# Altium project callisto_pcb.PrjPcb
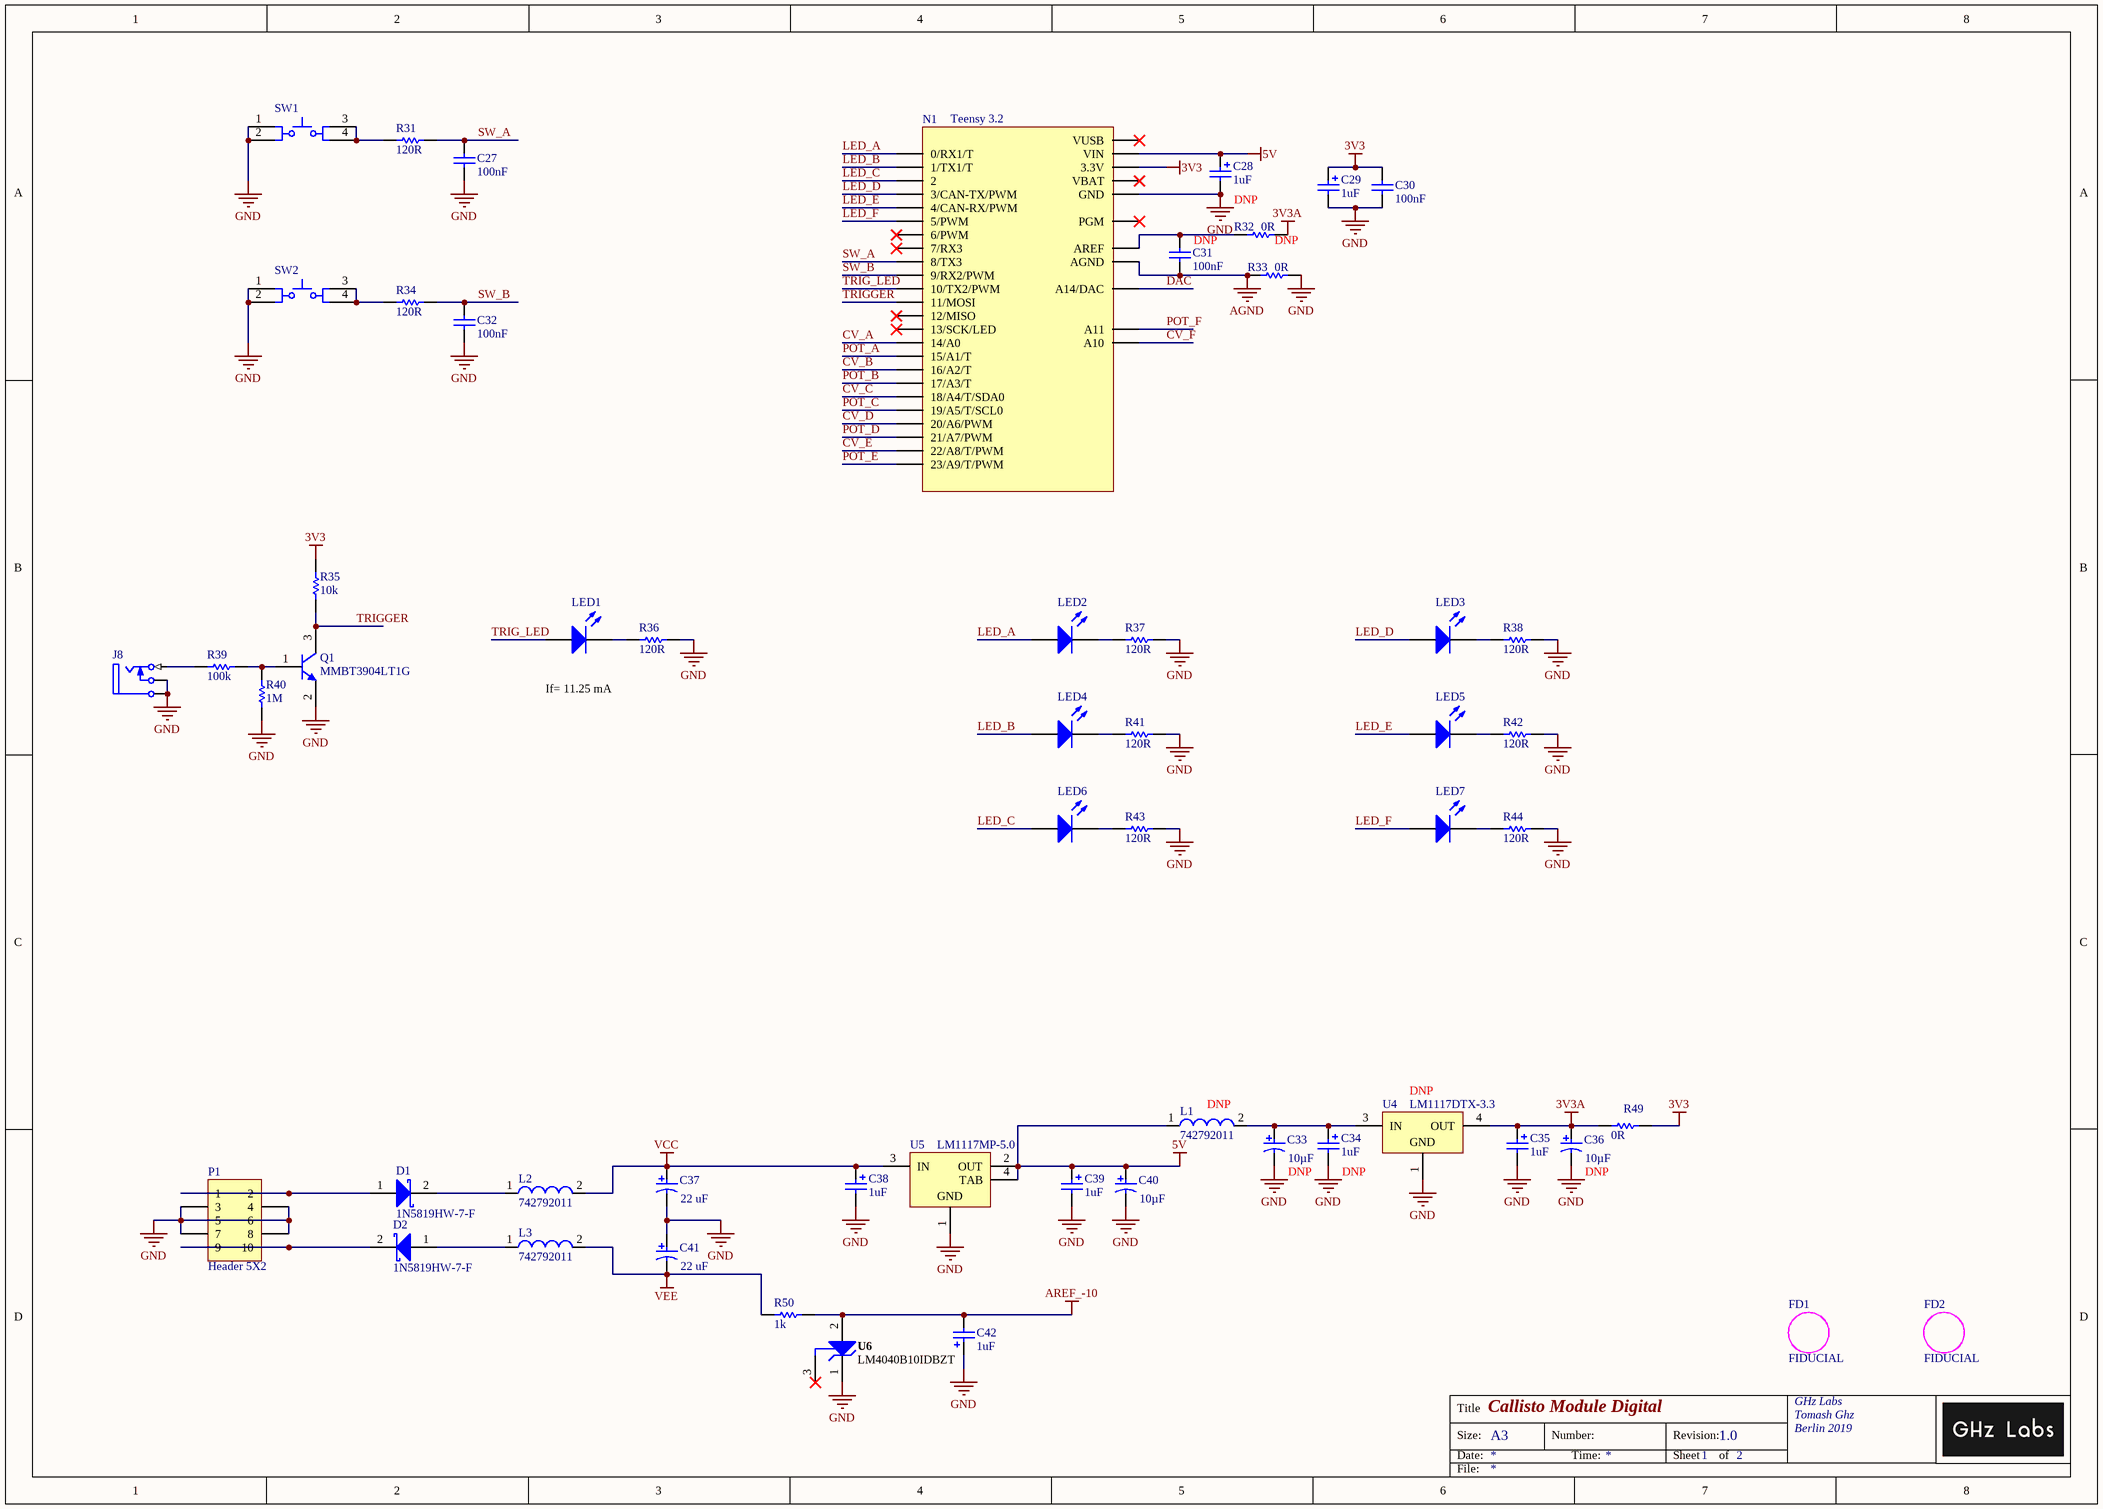
[diagram p0: callisto_schematics_digital.SchDoc]
2 sheets, 121 parts. Net scope: global (net labels, ports and power ports of the same name join across sheets).
Board files: callisto_board.PcbDoc, callisto_panel.PcbDoc
Sheets:
  callisto_schematics_digital.SchDoc
  callisto_schematics_analog.SchDoc

## Sheet callisto_schematics_digital.SchDoc: Callisto Module Digital
size A3; ApprovedBy: Tomash Ghz; CheckedBy: Tomash Ghz; Author: Tomash Ghz; CompanyName: GHz Labs; DrawnBy: Tomash Ghz; Engineer: Tomash Ghz; Organization: GHz Labs; Address1: Tomash Ghz; Address2: Berlin 2019; Revision: 1.0; SheetNumber: 1; SheetTotal: 2; DocumentName: Callisto Module Digital; ProjectName: Callisto Module

### Parts
C27  100nF  [CAPA_0805]
C28  1uF  [CAPA_0805 Pol]
C29  1uF  [CAPA_0805 Pol]
C30  100nF  [CAPA_0805]
C31  100nF  [CAPA_0805]
C32  100nF  [CAPA_0805]
C33  Capacitance: 10µF  [PNSC-FK-V-B_V]  (hidden comment: EEE-FK1V100UR)
C34  1uF  [CAPA_0805 Pol]
C35  1uF  [CAPA_0805 Pol]
C36  Capacitance: 10µF  [PNSC-FK-V-B_V]  (hidden comment: EEE-FK1V100UR)
C37  Rated Capacitance: 22 uF  [NIC-CAPA2-5X5.8_V]  (hidden comment: 22uF Electrolytic Capacitor)
C38  1uF  [CAPA_0805 Pol]
C39  1uF  [CAPA_0805 Pol]
C40  Capacitance: 10µF  [PNSC-FK-V-B_V]  (hidden comment: 10uF Electrolytic Capacitor)
C41  Rated Capacitance: 22 uF  [NIC-CAPA2-5X5.8_V]  (hidden comment: 22uF Electrolytic Capacitor)
C42  1uF  [CAPA_0805 Pol]
D1  1N5819HW-7-F  [DIOD-SOD-123-2_V]
D2  1N5819HW-7-F  [DIOD-SOD-123-2_V]
FD1  FIDUCIAL  [FIDUCIAL]  (no BOM)
FD2  FIDUCIAL  [FIDUCIAL]  (no BOM)
J8  Phonejack2 TN  [Thonkiconn]  (value not drawn)
L1  742792011  [SMD-0805]
L2  742792011  [SMD-0805]
L3  742792011  [SMD-0805]
LED1  WP424YDT  [Type 3mm]  (value not drawn)
LED2  WP424YDT  [Type 3mm]  (value not drawn)
LED3  WP424YDT  [Type 3mm]  (value not drawn)
LED4  WP424YDT  [Type 3mm]  (value not drawn)
LED5  WP424YDT  [Type 3mm]  (value not drawn)
LED6  WP424YDT  [Type 3mm]  (value not drawn)
LED7  WP424YDT  [Type 3mm]  (value not drawn)
N1  Teensy 3.2  [TEENSY_3.0-3.2&LC_ALL_PINS]
P1  Header 5X2  [HDR2X5]
Q1  MMBT3904LT1G  [ONSC-SOT-23-3-318-08_V]
R31  120R  [RES_0805]
R32  0R  [RES_0805]
R33  0R  [RES_0805]
R34  120R  [RES_0805]
R35  10k  [RES_0805]
R36  120R  [RES_0805]
R37  120R  [RES_0805]
R38  120R  [RES_0805]
R39  100k  [RES_0805]
R40  1M  [RES_0805]
R41  120R  [RES_0805]
R42  120R  [RES_0805]
R43  120R  [RES_0805]
R44  120R  [RES_0805]
R49  0R  [RES_0805]
R50  1k  [RES_0805]
SW1  Tact Switch  [ESWI-TL1105SPF_V]  (value not drawn)
SW2  Tact Switch  [ESWI-TL1105SPF_V]  (value not drawn)
U4  LM1117DTX-3.3  [TD03B_M]
U5  LM1117MP-5.0  [MP04A_M]
U6  LM4040B10IDBZT  [DBZ0003A_M]

### Nets
3V3: C29.1 C30.1 N1.3.3V_3.3V1(3.3V) R35.1 R49.2
3V3A: C35.1 C36.1 R32.2 R49.1 U4.4(OUT)
5V: C28.1 C39.1 C40.1 L1.1 N1.VIN U5.2(OUT) U5.4(TAB)
AGND: C31.2 N1.AGND R33.1
AREF_-10: C42.2 R50.1 U6.2(ANODE)
GND: C27.2 C28.2 C29.2 C30.2 C32.2 C33.2 C34.2 C35.2 C36.2 C37.2 C38.2 C39.2 C40.2 C41.1 C42.1 J8.2(TN) J8.5(S) N1.GND_GND1(GND) P1.3 P1.4 P1.5 P1.6 P1.7 P1.8 Q1.2(E) R33.2 R36.1 R37.1 R38.1 R40.2 R41.1 R42.1 R43.1 R44.1 SW1.1 SW1.2 SW2.1 SW2.2 U4.1(GND) U5.1(GND) U6.1(CATHODE)
VCC: C37.1 C38.1 L2.2 U5.3(IN)
VEE: C41.2 L3.2 R50.2
CV_A: N1.14/A0
CV_B: N1.16/A2(16/A2/T)
CV_C: N1.18/A4(18/A4/T/SDA0)
CV_D: N1.20/A6(20/A6/PWM)
CV_E: N1.22/A8(22/A8/T/PWM)
CV_F: N1.A10
DAC: N1.RESET/DAC(A14/DAC)
LED_A: LED2.2(A) N1.0(0/RX1/T)
LED_B: LED4.2(A) N1.1(1/TX1/T)
LED_C: LED6.2(A) N1.2
LED_D: LED3.2(A) N1.3(3/CAN-TX/PWM)
LED_E: LED5.2(A) N1.4(4/CAN-RX/PWM)
LED_F: LED7.2(A) N1.5(5/PWM)
POT_A: N1.15/A1(15/A1/T)
POT_B: N1.17/A3(17/A3/T)
POT_C: N1.19/A5(19/A5/T/SCL0)
POT_D: N1.21/A7(21/A7/PWM)
POT_E: N1.23/A9(23/A9/T/PWM)
POT_F: N1.A11
SW_A: C27.1 N1.8(8/TX3) R31.1
SW_B: C32.1 N1.9(9/RX2/PWM) R34.1
TRIG_LED: LED1.2(A) N1.10(10/TX2/PWM)
TRIGGER: N1.11(11/MOSI) Q1.3(C) R35.2
NetC31_1: C31.1 N1.AREF R32.1
NetC33_1: C33.1 C34.1 L1.2 U4.3(IN)
NetD1_1: D1.1(A) P1.1 P1.2
NetD1_2: D1.2(K) L2.1
NetD2_1: D2.1(A) L3.1
NetD2_2: D2.2(K) P1.9 P1.10
NetJ8_1: J8.1(T) R39.2
NetLED1_1: LED1.1(K) R36.2
NetLED2_1: LED2.1(K) R37.2
NetLED3_1: LED3.1(K) R38.2
NetLED4_1: LED4.1(K) R41.2
NetLED5_1: LED5.1(K) R42.2
NetLED6_1: LED6.1(K) R43.2
NetLED7_1: LED7.1(K) R44.2
NetQ1_1: Q1.1(B) R39.1 R40.1
NetR31_2: R31.2 SW1.3 SW1.4
NetR34_2: R34.2 SW2.3 SW2.4

Not connected (* = marked no-connect by the designer): N1 6(6/PWM)* 7(7/RX3)* 12(12/MISO)* 13(13/SCK/LED)* PGM* VBAT* VUSB*; U6 3(NC)*

### Notes on the sheet
- (near C31) DNP
- DNP
- (near R32) DNP
- If= 11.25 mA
- (near L1) DNP
- (near U4) DNP
- (near C36) DNP
- Title
- Size:
- Date:
- A3
- Number:
- Time:
- Revision:
- Sheet
- of
- File:

### Library data of the parts
C27 C30-C32 = Cap: Capacitor; PartNumber: C0805C104K4RAC; Manufacturer: KEMET; Published: 8-Jun-2000; LatestRevisionDate: 17-Jul-2002; LatestRevisionNote: Re-released for DXP Platform.; PackageReference: RAD-0.3; Publisher: Altium Limited; PackageDescription: Radial Cap, Thru-Hole; 2 Leads; 0.3 in Pin Spacing; Value: 100nF
C28 C29 C34 C35 C38 C39 C42 = Cap Pol2: Polarized Capacitor; PartNumber: GRM21BR61C105KA01L; Manufacturer: Murata Electronics; Value: 1uF; Mouser: http://www.mouser.de/ProductDetail/Murata-Electronics/GRM21BR61C105KA01L/?qs=sGAEpiMZZMs0AnBnWHyRQHqtMhGnfkOVy3Os4ZS1iuU%3d
C33 C36 = CMP-2000-06211-1: Aluminum Electrolytic Capacitor, 10 uF, +/- 20%, 35 V, 2-Pin SMD (Size Code B), -55 to 105 degC, RoHS, Tape and Reel; Manufacturer: Panasonic; Impedance: 1.35O; Rated Voltage: 35V; Lifetime@Temperature: 2000Hrs@105°C; Ripple Current: 90mA; Type: Can; Manufacturer URL: http://www.panasonic.com/; Package Reference: FK-V-B; Operating Temp Range: -55to+105°C; Series: FK; Datasheet URL: http://industrial.panasonic.com/cdbs/www-data/pdf/RDE0000/ABA0000C1181.pdf; Mounting Technology: SurfaceMount; Package URL: http://industrial.panasonic.com/cdbs/www-data/pdf/RDE0000/DME0000COL48.pdf; Package Description: 2-Pin Electrolytic Aluminum Capacitor, Body 4.3 x 4.3 mm; Datasheet Version: 03/2016; Case Size/Dimension: Ø4x5.8mm; Operating Temp-Max: 105°C
C37 C41 = CMP-0687-00027-1: Aluminum Electrolytic Capacitor, UD Series, Low Impedance, 22 uF, 16 V, + / - 20%, -55 to 105 degC, Chip Type, 5 x 5.8 mm D x L, Pb-Free, Reel; PartNumber: EEE-FK1V220R; Manufacturer: Panasonic; Tolerance Rated Capacitance: -20 to 20%; Endurance Time: 2000 h; Impedance: 0.76 Ohm; Rated Voltage: 16 V; Rated Ripple Current (at 100kHz): 150 mA; Packing: Dia382mm Reel; RoHS: TRUE; ComponentLink1URL: http://www.nichicon.co.jp/; PackageReference: CAPAE-D5H5.8; ComponentLink2URL: http://products.nichicon.co.jp/en/pdf/XJA043/e-ud.pdf; ComponentLink3URL: http://products.nichicon.co.jp/en/pdf/XJA043/e-ud.pdf; PackageDescription: 2-Pin Surface Mount Device, Diameter 5 mm, Height 5.8 mm, Pitch 4.4 mm; DatasheetVersion: 08/2012; Mounting Technology: Surface Mount; ComponentLink1Description: Manufacturer URL; Diameter: 5 mm; ComponentLink2Description: Datasheet; Length: 5.8 mm; ComponentLink3Description: Package Specification; Value: 22uF
C40 = CMP-2000-06211-1: Aluminum Electrolytic Capacitor, 10 uF, +/- 20%, 35 V, 2-Pin SMD (Size Code B), -55 to 105 degC, RoHS, Tape and Reel; Manufacturer: Panasonic; PartNumber: EEE-FK1E100R; Impedance: 1.35O; Rated Voltage: 35V; Lifetime@Temperature: 2000Hrs@105°C; Ripple Current: 90mA; Type: Can; Manufacturer URL: http://www.panasonic.com/; Package Reference: FK-V-B; Operating Temp Range: -55to+105°C; Series: FK; Datasheet URL: http://industrial.panasonic.com/cdbs/www-data/pdf/RDE0000/ABA0000C1181.pdf; Mounting Technology: SurfaceMount; Package URL: http://industrial.panasonic.com/cdbs/www-data/pdf/RDE0000/DME0000COL48.pdf; Package Description: 2-Pin Electrolytic Aluminum Capacitor, Body 4.3 x 4.3 mm; Datasheet Version: 03/2016; Case Size/Dimension: Ø4x5.8mm; Operating Temp-Max: 105°C; Value: 10uF
D1 D2 = CMP-0303-00003-1: 1.0 A Surface Mount Schottky Barrier Rectifier, 40 V, -65 to 125 degC, 2-Pin SOD-123 Package, RoHS, Tape and Reel; Manufacturer: Diodes Inc; @ VR (V): 40; @ Terminal Temperature TT (degC): 90; Maximum Average Rectified Current IO (A): 1; Total Capacitance CT (pF): 50; Peak Forward Surge Current IFSM (A): 25; Forward Voltage Drop VF (V): 0.45; VR (RMS) (V): 28; RoHS: TRUE; PartNumber: 1N5819HW-7-F; ComponentLink2URL: http://www.diodes.com/datasheets/ds30217.pdf; PackageDescription: 2-Pin SOD-123, Body 2.7 x 1.55 mm, Pitch 3.7 mm; @ IF (A): 1; Operating and Storage Temperature Range: -65 to 125 degC; ComponentLink1Description: Manufacturer URL; ComponentLink2Description: Datasheet; ComponentLink1URL: http://www.diodes.com/; Mounting Technology: Surface Mount; DatasheetVersion: Rev. 15-2; PackageReference: SOD-123-2; Maximum Reverse Current IR (uA): 50; Peak Repetitive Reverse Voltage VRRM (V): 40; Packing: Tape and Reel
FD1 FD2 = FIDUCIAL_ROUND: Fiducial - Round 1.5 mm Top-Bottom; Manufacturer: No Vendor; PartNumber: FIDUCIAL
J8 = Phonejack2 TN: Jack Socket; Part: ACJM-MV35-2S; Manufacturer: Thonk; PartNumber: PJ398SM; Mouser: http://www.mouser.de/ProductDetail/Amphenol/ACJM-MV35-2S/?qs=%2fha2pyFaduh8uNgKuHZ7oEtHXwcSE0WAH4R1pjDPuhAHZsUXTeJRNg%3d%3d; Datasheet: http://www.amphenolaudio.com/wp-content/uploads/2015/07/55010544-001-rev-2.pdf; Thonk: https://www.thonk.co.uk/shop/3-5mm-jacks/
L1 = CMP-0220-00043-1: SMD EMI Suppression Ferrite Bead WE-CBF, Z = 10 Ohm; Impedance: 10 Ohm; PackageDescription: Chip Inductor, 2-Leads, Body 2.0 x 1.2 mm; PackageReference: SMD-0805; ComponentLink1URL: http://www.we-online.com; PackageVersion: 2005; ComponentLink2Description: Datasheet; ComponentLink2URL: http://www.we-online.de/katalog/media/pdf/742792011.pdf; ComponentLink1Description: Manufacturer Link; DatasheetVersion: Dec-2005
L2 L3 = CMP-0220-00043-1: SMD EMI Suppression Ferrite Bead WE-CBF, Z = 10 Ohm; Manufacturer: Wurth Elektronik; Impedance: 10 Ohm; PackageDescription: Chip Inductor, 2-Leads, Body 2.0 x 1.2 mm; PackageReference: SMD-0805; ComponentLink1URL: http://www.we-online.com; PackageVersion: 2005; ComponentLink2Description: Datasheet; ComponentLink2URL: http://www.we-online.de/katalog/media/pdf/742792011.pdf; ComponentLink1Description: Manufacturer Link; DatasheetVersion: Dec-2005; PartNumber: 742792011
LED1-LED7 = CMP-1488-00001-1: THT LED round mono-color color lens, WL-TMRC, Bright Green; Manufacturer: Kingbright; ComponentLink1URL: http://www.we-online.com; Emitting color: Bright Green; ComponentLink2URL: http://katalog.we-online.de/pbs/datasheet/7448042001.pdfhttp://katalog.we-online.de/pbs/datasheet/7448042001.pdfhttp://katalog.we-online.de/pbs/datasheet/7448042001.pdfhttp://katalog.we-online.de/pbs/datasheet/151031VS04000.pdf; PartNumber: WP424YDT; PackageReference: Type 3mm; ComponentLink2Description: Datasheet; ComponentLink1Description: Manufacturer URL
N1 = TEENSY_3.1-3.2_ALL_PINS: Teensy 3.2 MCU; pin to pad: 3.3V 3.3V1>3.3V GND GND1>GND; PartNumber: DEV-13736; Manufacturer: SparkFun; Mouser: http://www.mouser.de/ProductDetail/SparkFun/DEV-13736/?qs=sGAEpiMZZMuWWq7rhECaKVjnUlbUDjFgBj37EAXueZA%3d
P1 = Header 5X2: Header, 5-Pin, Dual row; PartNumber: 67996-410HLF; Manufacturer: FCI Amphenol; LatestRevisionDate: 17-Jul-2002; LatestRevisionNote: Re-released for DXP Platform.; Publisher: Altium Limited
Q1 = CMP-1048-00631-1: General Purpose Transistor, NPN Silicon, 3-Pin SOT-23, Pb-Free, Tape and Reel; Manufacturer: On Semiconductor; IC Continuous (A): 0.2; fT Min (MHz): 300; ComponentLink2Description: Datasheet; Polarity: NPN; PackageDescription: 3-Pin Small Outline Transistor, Body 2.92 x 1.3 mm, Pitch 0.95 mm; ComponentLink2URL: http://www.onsemi.cn/pub_link/Collateral/MMBT3904LT1-D.PDF; DatasheetVersion: Rev. 12; Mounting Technology: Surface Mount; PartNumber: MMBT3904LT1G; ComponentLink1URL: http://www.onsemi.com/; ComponentLink3Description: Package Specification; ComponentLink1Description: Manufacturer URL; PackageVersion: Rev. AP, 11/2009; PackageReference: SOT-23-3-318-08; Packing: Tape and Reel; ComponentLink3URL: http://www.onsemi.cn/pub_link/Collateral/318-08.PDF; RoHS: TRUE
R31 R34 R36-R38 R41-R44 = Resistor: 120R 0805; PartNumber: CRCW0805120RJNEA; Manufacturer: Vishay; Value: 120R; Mouser: http://www.mouser.de/ProductDetail/Susumu/RR1220P-105-D/?qs=sGAEpiMZZMu61qfTUdNhG%2fDhcyQpRg8MxiYDTLm9lx4%3d
R32 R33 R49 = Resistor: 0R 0805; PartNumber: CRCW08050000Z0EA; Manufacturer: Vishay; Value: 0R; Mouser: http://www.mouser.de/ProductDetail/Susumu/RR1220P-104-D/?qs=sGAEpiMZZMu61qfTUdNhG%2fDhcyQpRg8MUHr%252b%2fl2FgBo%3d
R35 = Resistor: 10k 0805; PartNumber: RR1220P-103-D; Manufacturer: Susumu; Value: 10k; Mouser: http://www.mouser.de/ProductDetail/Susumu/RR1220P-105-D/?qs=sGAEpiMZZMu61qfTUdNhG%2fDhcyQpRg8MxiYDTLm9lx4%3d
R39 = Resistor: 100k 0805; PartNumber: RR1220P-104-D; Manufacturer: Susumu; Value: 100k; Mouser: http://www.mouser.de/ProductDetail/Susumu/RR1220P-105-D/?qs=sGAEpiMZZMu61qfTUdNhG%2fDhcyQpRg8MxiYDTLm9lx4%3d
R40 = Resistor: 1M 0805; PartNumber: RR1220P-105-D; Manufacturer: Susumu; Value: 1M; Mouser: http://www.mouser.de/ProductDetail/Susumu/RR1220P-105-D/?qs=sGAEpiMZZMu61qfTUdNhG%2fDhcyQpRg8MxiYDTLm9lx4%3d
R50 = Resistor: 1k 0805; PartNumber: RR1220P-102-D; Manufacturer: Susumu; Value: 1k; Mouser: http://www.mouser.de/ProductDetail/Susumu/RR1220P-103-D/?qs=sGAEpiMZZMu61qfTUdNhG%2fDhcyQpRg8MdkVTtHR2gV4%3d
SW1 SW2 = CMP-2000-07248-1: Tact Switch, SPST-NO, 50 mA, 12 VDC, -20 to 70 degC, 4-Pin THD, RoHS, Bulk; Manufacturer: E-Switch; PartNumber: TL1105SPF100Q; Actuation Force: 1.6N; Actuator Style: RoundButton; Package URL: http://spec_sheets.e-switch.com/specs/P010201.pdf; Contact Material: Silver; Size: 6x6mm; Manufacturer URL: http://www.e-switch.ch/en/; Datasheet Version: 12/2013; Package Description: 4-Pin Through Hole Device, Body 6 x 6 mm; Datasheet URL: https://www.e-switch.com/system/asset/product_line/data_sheet/140/TL1105.pdf; Termination Style: RightAngle; Package Reference: TL1105SPF; Mounting Technology: ThroughHole
U4 = CMP-0062-00706-2: 800mA Low-Dropout Linear Regulator, 3-pin TO-252; Manufacturer: National Semiconductor; PackageTopMarking: NSUZXYTT*LM1117*DT-3.3; PowerWise: N; CompType: LDO IC; ComponentLink3URL: http://www.national.com/packaging/folders/td03b.html; ComponentLink2URL: http://www.national.com/pf/LM/LM1117.html; ComponentLink2Description: LM1117 Web Page; PinCount: 3; ComponentLink1URL: http://www.national.com/ds/LM/LM1117.pdf; ComponentLink3Description: TD03B Package Page; Code_JEDEC: TO-252-AA; ComponentLink1Description: LM1117 Datasheet; PackageVersion: revD, Feb-2009; RevisionNote: Component URLs added; RoHS: N; DatasheetVersion: Apr-2006; PackageReference: TD03B; PackageDescription: TO252, Molded, Jedec, 6.8 x 6.10 x 2.30mm Body, 3 Lead, 2.28mm Pitch, Surface Mount
U5 = CMP-0062-01640-3: 800mA Low-Dropout Linear Regulator, 4-pin SOT-223; Manufacturer: National Semiconductor; CompType: LDO IC; PackageTopMarking: XYTT*N06A; High-Reliability: Y; PowerWise: N; Code_IPC: SOT223-4; PackageVersion: revB, Apr-2003; RoHS: N; Code_JEDEC: TO-261-AA; PinCount: 4; ComponentLink1URL: http://www.national.com/; ComponentLink4URL: http://www.national.com/packaging/folders/mp04a.html; RevisionNote: SCH symbol layout adjusted; PackageDescription: Molded SOT-223, 6.50 x 3.56 x 1.6mm Body, 4 Lead, 2.3mm Pitch; DatasheetVersion: Apr-2006; ComponentLink3URL: http://www.national.com/pf/LM/LM1117.html; ComponentLink2URL: http://www.national.com/ds/LM/LM1117.pdf; PartNumber: LM1117MP-5.0; ComponentLink2Description: LM1117 Datasheet; ComponentLink3Description: LM1117 Web Page; ComponentLink4Description: MP04A Package Page; PackageReference: MP04A; ComponentLink1Description: Manufacturer URL
U6 = CMP-0366-01043-2: Precision Micropower Shunt Voltage Reference, 0.2% Accuracy, 10 V, 15 ppm / degC, 15 mA, -40 to 85 degC, 3-pin SOT-23 (DBZ), Green (RoHS & no Sb/Br); Manufacturer: Texas Instruments; Temp Coeff(Max)(ppm/ degree C): 100; Rating: Catalog; VO(V): 10; Iout/Iz(Max)(mA): 15; Initial Accuracy @ 25/deg C(%): 0.2; ComponentLink2Description: Datasheet; ComponentLink1URL: http://www.ti.com/; ComponentLink4URL: Samples URL:http://www.ti.com/product/lm4040b10; ComponentLink3Description: Package Specification; PartNumber: LM4040B10IDBZT; DatasheetVersion: SLOS456K; Mounting Technology: Surface Mount; Eco-Plan: Green (RoHS & no Sb/Br); Code_JEDEC: TO-236; SubFamily: Shunt Voltage Reference; PackageDescription: 3-Pin Plastic Small Outline, Body 2.92 x 1.3 mm, Pitch 0.95 mm; ComponentLink2URL: http://www.ti.com/general/docs/lit/getliterature.tsp?genericPartNumber=LM4040B10&fileType=pdf; PackageVersion: 4203227/B; ComponentLink1Description: Manufacturer URL; ComponentLink3URL: http://www.ti.com/litv/pdf/mpds108a; Temp Coeff(Typ)(ppm/ degree C): 15; ComponentLink4Description: URL Link1; Min Iz for Regulation(uA): 100; PackageReference: DBZ0003A

## Sheet callisto_schematics_analog.SchDoc: Callisto Module Analog
size A3; Author: Tomash Ghz; CompanyName: GHz Labs; DrawnBy: Tomash Ghz; Engineer: Tomash Ghz; Organization: GHz Labs; Address1: Tomash Ghz; Address2: Berlin 2019; Revision: 1.0; SheetNumber: 2; SheetTotal: 2; DocumentName: Callisto Module Analog; ProjectName: Callisto
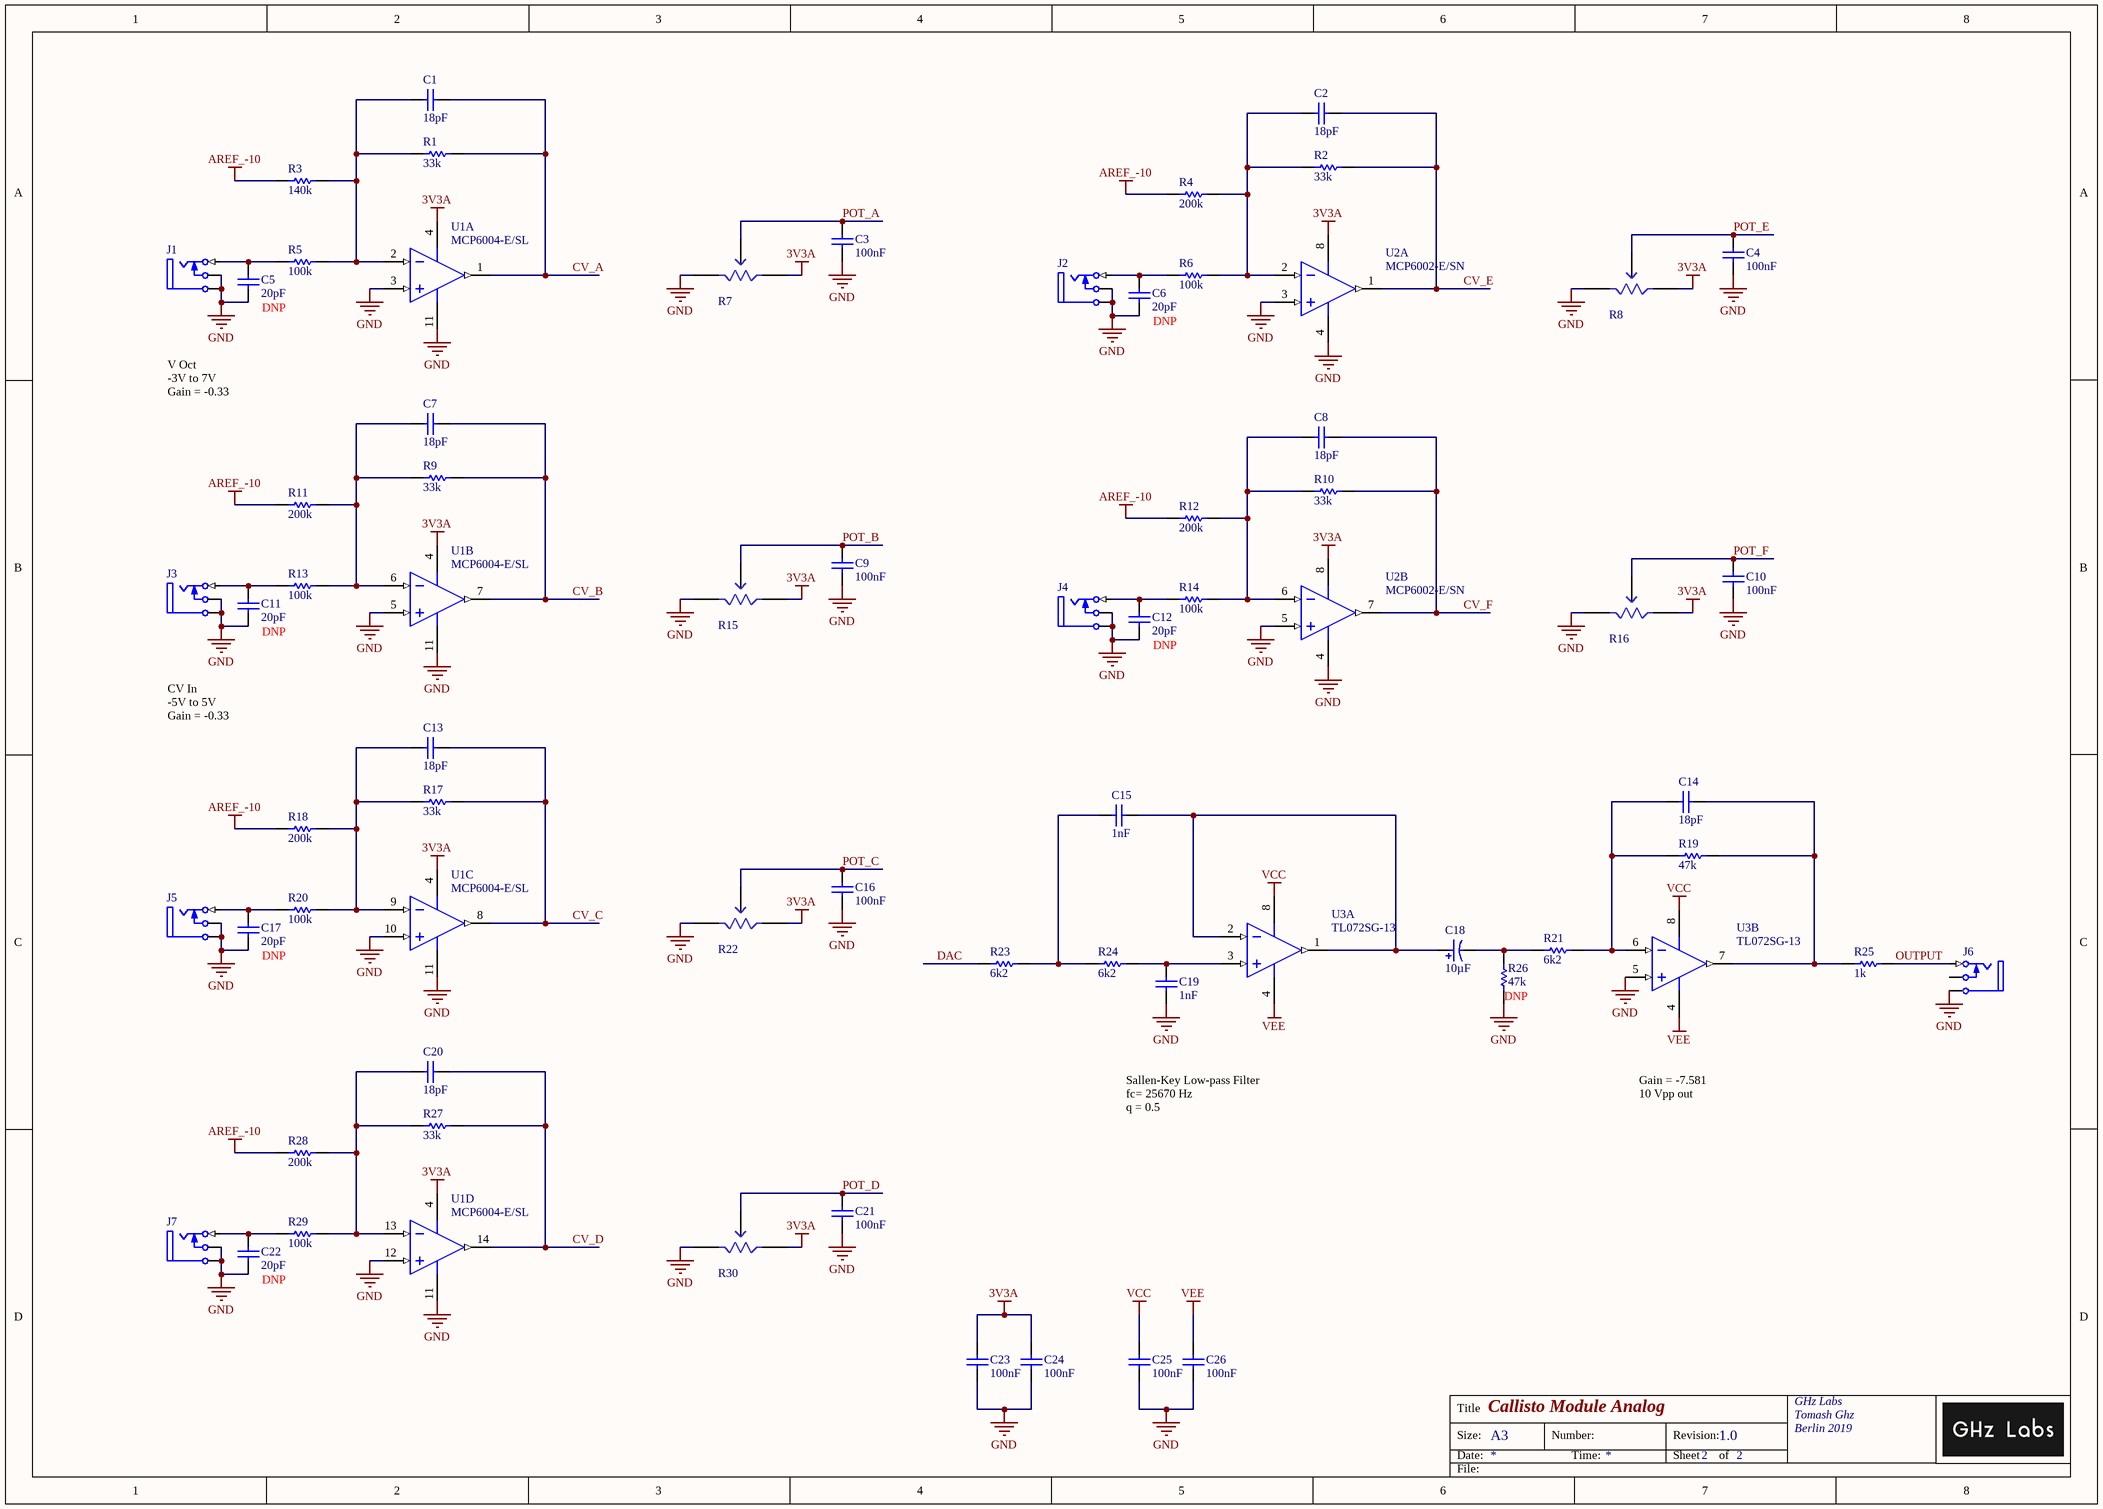
[diagram p1: callisto_schematics_analog.SchDoc]

### Parts
C1  18pF  [CAPA_0805]
C2  18pF  [CAPA_0805]
C3  100nF  [CAPA_0805]
C4  100nF  [CAPA_0805]
C5  20pF  [CAPA_0805]
C6  20pF  [CAPA_0805]
C7  18pF  [CAPA_0805]
C8  18pF  [CAPA_0805]
C9  100nF  [CAPA_0805]
C10  100nF  [CAPA_0805]
C11  20pF  [CAPA_0805]
C12  20pF  [CAPA_0805]
C13  18pF  [CAPA_0805]
C14  18pF  [CAPA_0805]
C15  1nF  [CAPA_0805]
C16  100nF  [CAPA_0805]
C17  20pF  [CAPA_0805]
C18  Capacitance: 10µF  [PNSC-FK-V-B_V]  (hidden comment: 10uF Electrolytic Capacitor)
C19  1nF  [CAPA_0805]
C20  18pF  [CAPA_0805]
C21  100nF  [CAPA_0805]
C22  20pF  [CAPA_0805]
C23  100nF  [CAPA_0805]
C24  100nF  [CAPA_0805]
C25  100nF  [CAPA_0805]
C26  100nF  [CAPA_0805]
J1  Phonejack2 TN  [Thonkiconn]  (value not drawn)
J2  Phonejack2 TN  [Thonkiconn]  (value not drawn)
J3  Phonejack2 TN  [Thonkiconn]  (value not drawn)
J4  Phonejack2 TN  [Thonkiconn]  (value not drawn)
J5  Phonejack2 TN  [Thonkiconn]  (value not drawn)
J6  Phonejack2 TN  [Thonkiconn]  (value not drawn)
J7  Phonejack2 TN  [Thonkiconn]  (value not drawn)
R1  33k  [RES_0805]
R2  33k  [RES_0805]
R3  140k  [RES_0805]
R4  200k  [RES_0805]
R5  100k  [RES_0805]
R6  100k  [RES_0805]
R7  Thumb Potentiometer  [POT-Thumb]  (value not drawn)
R8  Thumb Potentiometer  [POT-Thumb]  (value not drawn)
R9  33k  [RES_0805]
R10  33k  [RES_0805]
R11  200k  [RES_0805]
R12  200k  [RES_0805]
R13  100k  [RES_0805]
R14  100k  [RES_0805]
R15  Thumb Potentiometer  [POT-Thumb]  (value not drawn)
R16  Potentiometer  [POT-ALPHA]  (value not drawn)
R17  33k  [RES_0805]
R18  200k  [RES_0805]
R19  47k  [RES_0805]
R20  100k  [RES_0805]
R21  6k2  [RES_0805]
R22  Potentiometer  [POT-ALPHA]  (value not drawn)
R23  6k2  [RES_0805]
R24  6k2  [RES_0805]
R25  1k  [RES_0805]
R26  47k  [RES_0805]
R27  33k  [RES_0805]
R28  200k  [RES_0805]
R29  100k  [RES_0805]
R30  Potentiometer  [POT-ALPHA]  (value not drawn)
U1  MCP6004-E/SL  [SOIC-SL14_M]  (parts A,B,C,D of 4)
U2  MCP6002-E/SN  [SOIC-SN8_M]  (parts A,B of 2)
U3  TL072SG-13  [D0008A_M]  (parts A,B of 2)

### Nets
3V3A: C23.1 C24.1 R7.3 R8.3 R15.3 R16.3 R22.3 R30.3 U1.4(VDD) U2.8(VDD)
AREF_-10: R3.2 R4.2 R11.2 R12.2 R18.2 R28.2
GND: C3.2 C4.2 C5.1 C6.1 C9.2 C10.2 C11.1 C12.1 C16.2 C17.1 C19.1 C21.2 C22.1 C23.2 C24.2 C25.2 C26.2 J1.2(TN) J1.5(S) J2.2(TN) J2.5(S) J3.2(TN) J3.5(S) J4.2(TN) J4.5(S) J5.2(TN) J5.5(S) J6.5(S) J7.2(TN) J7.5(S) R7.1 R8.1 R15.1 R16.1 R22.1 R26.2 R30.1 U1.3(VINA+) U1.5(VINB+) U1.10(VINC+) U1.11(VSS) U1.12(VIND+) U2.3(VINA+) U2.4(VSS) U2.5(VINB+) U3.5(IN2+)
VCC: C25.1 U3.8(VCC+)
VEE: C26.1 U3.4(VCC-)
CV_A: C1.2 R1.1 U1.1(VOUTA)
CV_B: C7.2 R9.1 U1.7(VOUTB)
CV_C: C13.2 R17.1 U1.8(VOUTC)
CV_D: C20.2 R27.1 U1.14(VOUTD)
CV_E: C2.2 R2.1 U2.1(VOUTA)
CV_F: C8.2 R10.1 U2.7(VOUTB)
DAC: R23.2
OUTPUT: J6.1(T) R25.1
POT_A: C3.1 R7.2
POT_B: C9.1 R15.2
POT_C: C16.1 R22.2
POT_D: C21.1 R30.2
POT_E: C4.1 R8.2
POT_F: C10.1 R16.2
NetC1_1: C1.1 R1.2 R3.1 R5.1 U1.2(VINA-)
NetC2_1: C2.1 R2.2 R4.1 R6.1 U2.2(VINA-)
NetC5_2: C5.2 J1.1(T) R5.2
NetC6_2: C6.2 J2.1(T) R6.2
NetC7_1: C7.1 R9.2 R11.1 R13.1 U1.6(VINB-)
NetC8_1: C8.1 R10.2 R12.1 R14.1 U2.6(VINB-)
NetC11_2: C11.2 J3.1(T) R13.2
NetC12_2: C12.2 J4.1(T) R14.2
NetC13_1: C13.1 R17.2 R18.1 R20.1 U1.9(VINC-)
NetC14_1: C14.1 R19.2 R21.1 U3.6(IN2-)
NetC14_2: C14.2 R19.1 R25.2 U3.7(OUT2)
NetC15_1: C15.1 R23.1 R24.2
NetC15_2: C15.2 C18.1 U3.1(OUT1) U3.2(IN1-)
NetC17_2: C17.2 J5.1(T) R20.2
NetC18_2: C18.2 R21.2 R26.1
NetC19_2: C19.2 R24.1 U3.3(IN1+)
NetC20_1: C20.1 R27.2 R28.1 R29.1 U1.13(VIND-)
NetC22_2: C22.2 J7.1(T) R29.2

Not connected (* = marked no-connect by the designer): J6 2(TN)

### Notes on the sheet
- (near C5) DNP
- (near C6) DNP
- V Oct
  -3V to 7V
  Gain = -0.33
- (near C11) DNP
- (near C12) DNP
- CV In
  -5V to 5V
  Gain = -0.33
- (near C17) DNP
- (near R26) DNP
- Sallen-Key Low-pass Filter
  fc= 25670 Hz
  q = 0.5
- Gain = -7.581
  10 Vpp out
- (near C22) DNP
- Title
- Size:
- Date:
- A3
- Number:
- Time:
- Revision:
- Sheet
- of
- File:

### Library data of the parts
C1 C2 C7 C8 C13 C14 C20 = Cap: Capacitor; PartNumber: C0805C180J5GAC7210; Manufacturer: KEMET; Published: 8-Jun-2000; LatestRevisionDate: 17-Jul-2002; LatestRevisionNote: Re-released for DXP Platform.; PackageReference: RAD-0.3; Publisher: Altium Limited; PackageDescription: Radial Cap, Thru-Hole; 2 Leads; 0.3 in Pin Spacing; Value: 18pF
C3 C4 C9 C10 C16 C21 C23-C26 = Cap: Capacitor; Manufacturer: KEMET; PartNumber: C0805C104K4RAC; Published: 8-Jun-2000; LatestRevisionDate: 17-Jul-2002; LatestRevisionNote: Re-released for DXP Platform.; PackageReference: RAD-0.3; Publisher: Altium Limited; PackageDescription: Radial Cap, Thru-Hole; 2 Leads; 0.3 in Pin Spacing; Value: 100nF
C5 C6 C11 C12 C17 C22 = Cap: Capacitor; Published: 8-Jun-2000; LatestRevisionDate: 17-Jul-2002; LatestRevisionNote: Re-released for DXP Platform.; PackageReference: RAD-0.3; Publisher: Altium Limited; PackageDescription: Radial Cap, Thru-Hole; 2 Leads; 0.3 in Pin Spacing; Value: 20pF
C15 C19 = Cap: Capacitor; PartNumber: C0805C102K5GAC; Manufacturer: KEMET; Published: 8-Jun-2000; LatestRevisionDate: 17-Jul-2002; LatestRevisionNote: Re-released for DXP Platform.; PackageReference: RAD-0.3; Publisher: Altium Limited; PackageDescription: Radial Cap, Thru-Hole; 2 Leads; 0.3 in Pin Spacing; Value: 1nF
C18 = CMP-2000-06211-1: as C40 on sheet callisto_schematics_digital; Manufacturer URL: http://www.panasonic.com/; Package Reference: FK-V-B; Operating Temp Range: -55to+105°C; Series: FK; Datasheet URL: http://industrial.panasonic.com/cdbs/www-data/pdf/RDE0000/ABA0000C1181.pdf; Mounting Technology: SurfaceMount; Package URL: http://industrial.panasonic.com/cdbs/www-data/pdf/RDE0000/DME0000COL48.pdf; Package Description: 2-Pin Electrolytic Aluminum Capacitor, Body 4.3 x 4.3 mm; Datasheet Version: 03/2016; Case Size/Dimension: Ø4x5.8mm; Operating Temp-Max: 105°C; Value: 10uF
J1-J7 = Phonejack2 TN: as J8 on sheet callisto_schematics_digital; Mouser: http://www.mouser.de/ProductDetail/Amphenol/ACJM-MV35-2S/?qs=%2fha2pyFaduh8uNgKuHZ7oEtHXwcSE0WAH4R1pjDPuhAHZsUXTeJRNg%3d%3d; Datasheet: http://www.amphenolaudio.com/wp-content/uploads/2015/07/55010544-001-rev-2.pdf; Thonk: https://www.thonk.co.uk/shop/3-5mm-jacks/
R1 R2 R9 R10 R17 R27 = Resistor: 33k 0805; PartNumber: RR1220P-333-D; Manufacturer: Susumu; Value: 33k; Mouser: http://www.mouser.de/ProductDetail/Susumu/RR1220P-105-D/?qs=sGAEpiMZZMu61qfTUdNhG%2fDhcyQpRg8MxiYDTLm9lx4%3d
R3 = Resistor: 140k 0805; PartNumber: RR1220P-1403-D-M; Manufacturer: Susumu; Value: 140k; Mouser: http://www.mouser.de/ProductDetail/Susumu/RR1220P-105-D/?qs=sGAEpiMZZMu61qfTUdNhG%2fDhcyQpRg8MxiYDTLm9lx4%3d
R4 R11 R12 R18 R28 = Resistor: 200k 0805; PartNumber: RR1220P-204-D; Manufacturer: Susumu; Value: 200k; Mouser: http://www.mouser.de/ProductDetail/Susumu/RR1220P-105-D/?qs=sGAEpiMZZMu61qfTUdNhG%2fDhcyQpRg8MxiYDTLm9lx4%3d
R5 R6 R13 R14 R20 R29 = Resistor: as R39 on sheet callisto_schematics_digital; Value: 100k; Mouser: http://www.mouser.de/ProductDetail/Susumu/RR1220P-105-D/?qs=sGAEpiMZZMu61qfTUdNhG%2fDhcyQpRg8MxiYDTLm9lx4%3d
R7 R8 R15 = Potentiometer: PartNumber: PTV09A-4020U-B104; Manufacturer: Bourns; Value: 100k Linear; Mouser: http://www.mouser.de/Search/ProductDetail.aspx?R=PTV09A-4020U-B104virtualkey65210000virtualkey652-PTV09A4020U-B104
R16 R22 R30 = Potentiometer: PartNumber: P0915N-FC15BR100K; Manufacturer: TT Electronics; Value: 100k Linear; Mouser: http://www.mouser.de/Search/ProductDetail.aspx?R=PTV09A-4020U-B104virtualkey65210000virtualkey652-PTV09A4020U-B104
R19 R26 = Resistor: 47k 0805; PartNumber: RT0805FRE0747KL; Manufacturer: Yageo; Value: 47k; Mouser: http://www.mouser.de/ProductDetail/Susumu/RR1220P-105-D/?qs=sGAEpiMZZMu61qfTUdNhG%2fDhcyQpRg8MxiYDTLm9lx4%3d
R21 R23 R24 = Resistor: 6k2 0805; PartNumber: RT0805FRE076K2L; Manufacturer: Yageo; Value: 6k2; Mouser: http://www.mouser.de/ProductDetail/Susumu/RR1220P-105-D/?qs=sGAEpiMZZMu61qfTUdNhG%2fDhcyQpRg8MxiYDTLm9lx4%3d
R25 = Resistor: as R50 on sheet callisto_schematics_digital; Value: 1k; Mouser: http://www.mouser.de/ProductDetail/Susumu/RR1220P-105-D/?qs=sGAEpiMZZMu61qfTUdNhG%2fDhcyQpRg8MxiYDTLm9lx4%3d
U1 = MCP6004-E/SL: 1 MHz, Low-Power Operational Amplifier, 14-Pin SOIC, Extended Temperature; PartNumber: MCP6004T-E/SL; Manufacturer: Microchip Technology; Published: 29-Jan-2009; LatestRevisionDate: 02-Dec-2009; LatestRevisionNote: Updated to datasheet revision J, Nov-2009; DatasheetVersion: revJ, Nov-2009; PackageVersion: revBB, Aug-2009; PackageReference: SOIC-SL14; Publisher: Altium Limited; PackageDescription: 14-Lead Plastic Small Outline (SL) - Narrow, 3.90mm Body [SOIC]; Supplier 1: Digi-Key; Supplier Part Number 1: MCP6004-E/SL-ND; Supplier 2: Farnell; Supplier Part Number 2: 1332122; Code_JEDEC: MS-012-AB; Code_IPC: SOIC127P600-14; ComponentLink1Description: Datasheet; ComponentLink1URL: http://ww1.microchip.com/downloads/en/DeviceDoc/21733j.pdf; ComponentLink2Description: Packaging Specification; ComponentLink2URL: http://www.microchip.com/stellent/groups/techpub_sg/documents/packagingspec/en012702.pdf; ComponentLink3Description: Microchip.com Home; ComponentLink3URL: http://www.microchip.com/; Mouser: http://www.mouser.de/ProductDetail/Microchip-Technology/MCP6004T-E-SL/?qs=sGAEpiMZZMtCHixnSjNA6N5WMYiF%252b1miedbE5%2f40CfM%3d
U2 = CMP-0187-00368-2: 1 MHz, Low-Power Operational Amplifier, 8-Pin SOIC, Extended Temperature; Manufacturer: Microchip Technology; ComponentLink1URL: http://www.microchip.com/; ComponentLink2URL: http://ww1.microchip.com/downloads/en/DeviceDoc/21733j.pdf; ComponentLink3URL: http://www.microchip.com/stellent/groups/techpub_sg/documents/packagingspec/en012702.pdf; Code_JEDEC: MS-012; PackageVersion: revBB, Aug-2009; ComponentLink2Description: Datasheet; PackageDescription: 8-Lead Plastic Small Outline (SN) - Narrow, 3.90mm Body [SOIC]; PackageReference: SOIC-SN8; ComponentLink1Description: Manufacturer URL; RevisionNote: URLs added.; Code_IPC: SOIC127P600-8; ComponentLink3Description: Package Specification; DatasheetVersion: revJ, Nov-2009; PartNumber: MCP6002-E/SN
U3 = CMP-0015-00092-2: Low-Noise JFET-Input Operational Amplifier, 7 to 36 V, 0 to 70 degC, 8-pin SOIC (D8), Green (RoHS & no Sb/Br); Manufacturer: Diodes Incorporated; Iq per channel(Max)(mA): 2.5; Total Supply Voltage(Max)(+5V is 5, +/-5V is 10): 36; Total Supply Voltage(Min)(+5V is 5, +/-5V is 10): 7; GBW(Typ)(MHz): 3; Sub Family: General Purpose Amplifier, High Supply Voltage Amplifier (>=30V); Number of Channels: 2; CMRR(Min)(dB): 75; Vn at 1kHz(Typ)(nV/rtHz): 18; Vio (25C)(Max)(mV): 6; Rating: Catalog; Slew Rate(Typ)(V/us): 13; IIB(Max)(pA): 200; PartNumber: TL072SG-13; ComponentLink3Description: Package Specification; PackageDescription: 8-Pin Plastic Small Outline, Body 4.9 x 3.9 mm, Pitch 1.27 mm; ComponentLink1Description: Manufacturer URL; PackageVersion: 4040047-3/M, 06/2011; ComponentLink1URL: http://www.ti.com/; Code_JEDEC: MS-012; Mounting Technology: Surface Mount; ComponentLink3URL: http://www.ti.com/litv/pdf/msoi002j; ComponentLink2Description: Datasheet; Offset Drift(Typ)(uV/C): 18; PackageReference: D0008A; DatasheetVersion: SLOS080J; ComponentLink2URL: http://www.ti.com/lit/ds/symlink/tl072a.pdf; Eco-Plan: Green (RoHS & no Sb/Br)

## Nets that join several sheets
3V3A: callisto_schematics_digital (5 pins), callisto_schematics_analog (10 pins)
AREF_-10: callisto_schematics_digital (C42.2 R50.1 U6.2), callisto_schematics_analog (6 pins)
GND: callisto_schematics_digital (41 pins), callisto_schematics_analog (46 pins)
VCC: callisto_schematics_digital (C37.1 C38.1 L2.2 U5.3), callisto_schematics_analog (C25.1 U3.8)
VEE: callisto_schematics_digital (C41.2 L3.2 R50.2), callisto_schematics_analog (C26.1 U3.4)
CV_A: callisto_schematics_digital (N1.14/A0), callisto_schematics_analog (C1.2 R1.1 U1.1)
CV_B: callisto_schematics_digital (N1.16/A2), callisto_schematics_analog (C7.2 R9.1 U1.7)
CV_C: callisto_schematics_digital (N1.18/A4), callisto_schematics_analog (C13.2 R17.1 U1.8)
CV_D: callisto_schematics_digital (N1.20/A6), callisto_schematics_analog (C20.2 R27.1 U1.14)
CV_E: callisto_schematics_digital (N1.22/A8), callisto_schematics_analog (C2.2 R2.1 U2.1)
CV_F: callisto_schematics_digital (N1.A10), callisto_schematics_analog (C8.2 R10.1 U2.7)
DAC: callisto_schematics_digital (N1.RESET/DAC), callisto_schematics_analog (R23.2)
POT_A: callisto_schematics_digital (N1.15/A1), callisto_schematics_analog (C3.1 R7.2)
POT_B: callisto_schematics_digital (N1.17/A3), callisto_schematics_analog (C9.1 R15.2)
POT_C: callisto_schematics_digital (N1.19/A5), callisto_schematics_analog (C16.1 R22.2)
POT_D: callisto_schematics_digital (N1.21/A7), callisto_schematics_analog (C21.1 R30.2)
POT_E: callisto_schematics_digital (N1.23/A9), callisto_schematics_analog (C4.1 R8.2)
POT_F: callisto_schematics_digital (N1.A11), callisto_schematics_analog (C10.1 R16.2)

## Assembly variants
DNF: not fitted C5 C6 C11 C12 C17 C22 C28 C31 C33 C34 C36 L1 R26 R32 U4